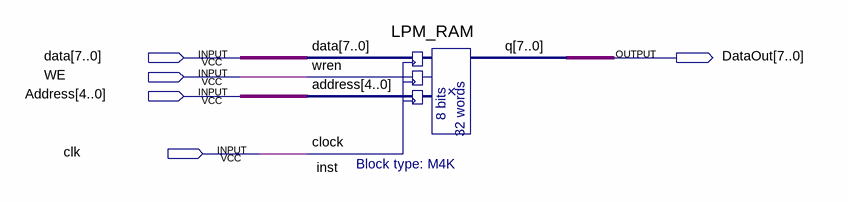
[diagram p0: schematic sheet]
// Quartus schematic MyMemory.bdf as structural Verilog: 1 symbols, 5 pins
module MyMemory (
  input  [7:0] data,
  input  WE,
  input  [4:0] Address,
  input  clk,
  output [7:0] DataOut
);

  LPM_RAM inst (.data(data), .wren(WE), .address(Address), .clock(clk), .q(DataOut));
endmodule
